# EAGLE schematic Arduino Shield Schematic (EAGLE 9.5.2)
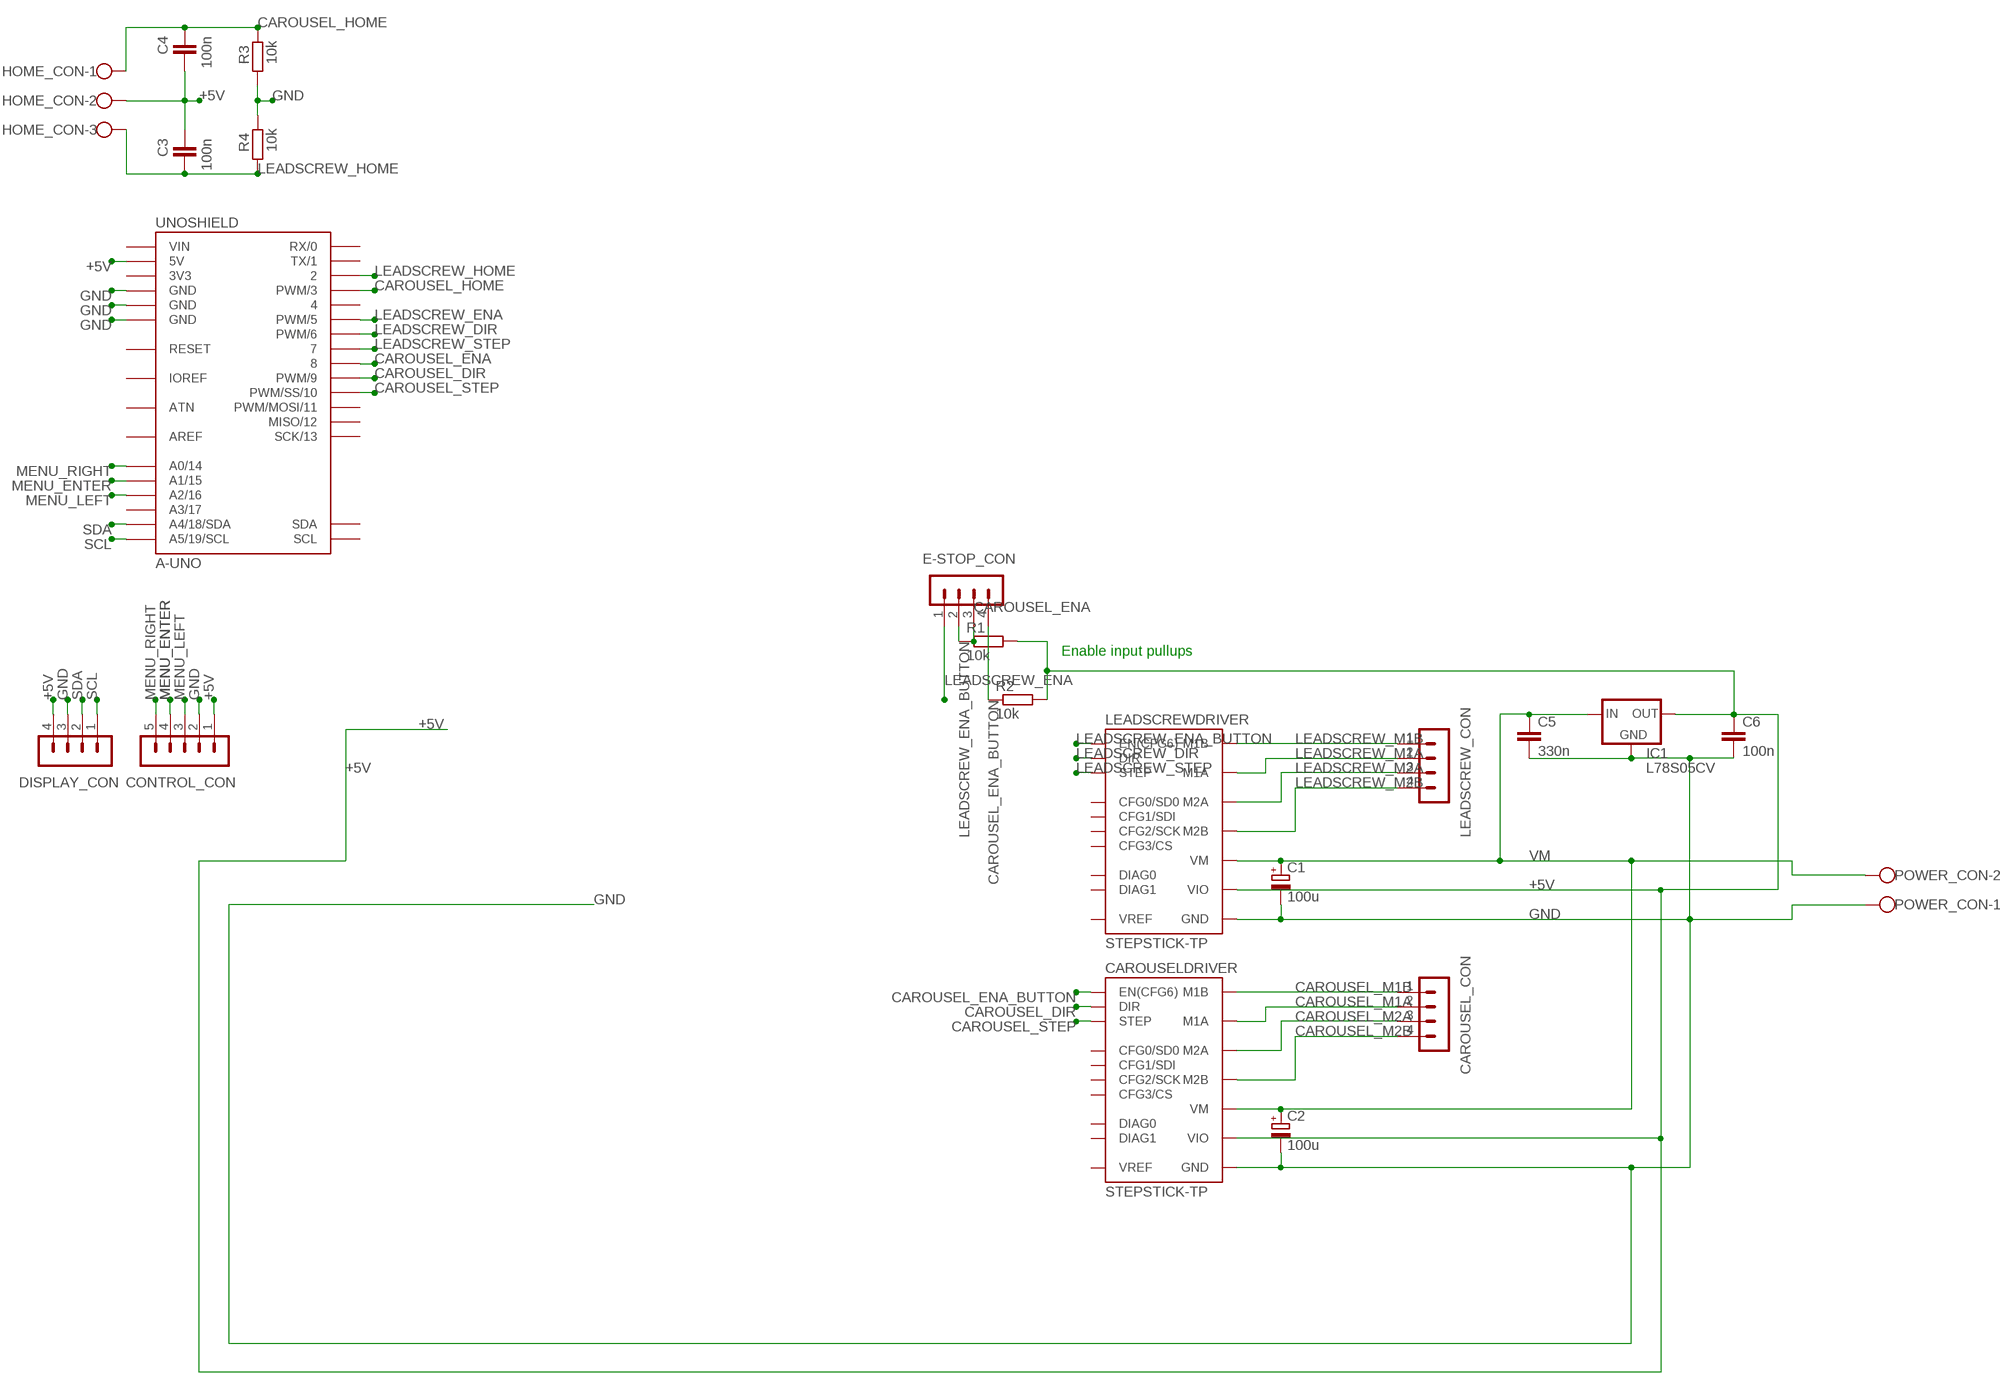
[diagram p0: schematic, sheet 1]

## Parts
C1  100u  CPOL-EUE3.5-8  [E3,5-8]
C2  100u  CPOL-EUE3.5-8  [E3,5-8]
C3  100n  C-EU025-024X044  [C025-024X044]
C4  100n  C-EU025-024X044  [C025-024X044]
C5  330n  C-EU025-030X050  [C025-030X050]
C6  100n  C-EU025-030X050  [C025-030X050]
CAROUSEL_CON  MA04-1  [MA04-1]
CAROUSELDRIVER  STEPSTICK-TP  [STEPSTICK_TP]
CONTROL_CON  MA05-1  [MA05-1]
DISPLAY_CON  MA04-1  [MA04-1]
E-STOP_CON  MA04-1  [MA04-1]
HOME_CON  W237-103  [W237-103]
IC1  L78S05CV  [TO-220-STANDING]
LEADSCREW_CON  MA04-1  [MA04-1]
LEADSCREWDRIVER  STEPSTICK-TP  [STEPSTICK_TP]
POWER_CON  W237-102  [W237-102]
R1  10k  R-EU_0207/12  [0207/12]
R2  10k  R-EU_0207/12  [0207/12]
R3  10k  R-EU_0207/10  [0207/10]
R4  10k  R-EU_0207/10  [0207/10]
UNOSHIELD  A-UNO  [A-UNO]

## Nets
+5V [Power]: C3.2 C4.1 C6.1 CAROUSELDRIVER.VIO CONTROL_CON.1 DISPLAY_CON.4 HOME_CON.2 IC1.3(OUT) LEADSCREWDRIVER.VIO R1.2 R2.2 UNOSHIELD.5V
CAROUSEL_DIR: CAROUSELDRIVER.DIR UNOSHIELD.9(PWM/9)
CAROUSEL_ENA: E-STOP_CON.3 UNOSHIELD.8
CAROUSEL_ENA_BUTTON: CAROUSELDRIVER.EN(EN(CFG6)) E-STOP_CON.4 R2.1
CAROUSEL_HOME: C4.2 HOME_CON.1 R3.2 UNOSHIELD.3(PWM/3)
CAROUSEL_M1A [Motors]: CAROUSEL_CON.2 CAROUSELDRIVER.M1A
CAROUSEL_M1B [Motors]: CAROUSEL_CON.1 CAROUSELDRIVER.M1B
CAROUSEL_M2A [Motors]: CAROUSEL_CON.3 CAROUSELDRIVER.M2A
CAROUSEL_M2B [Motors]: CAROUSEL_CON.4 CAROUSELDRIVER.M2B
CAROUSEL_STEP: CAROUSELDRIVER.STEP UNOSHIELD.10(PWM/SS/10)
GND [Power]: C1.- C2.- C5.2 C6.2 CAROUSELDRIVER.GND@1(GND) CAROUSELDRIVER.GND@2(GND) CONTROL_CON.2 DISPLAY_CON.3 IC1.2(GND) LEADSCREWDRIVER.GND@1(GND) LEADSCREWDRIVER.GND@2(GND) POWER_CON.1 R3.1 R4.2 UNOSHIELD.GND@1(GND) UNOSHIELD.GND@2(GND) UNOSHIELD.GND@3(GND)
LEADSCREW_DIR: LEADSCREWDRIVER.DIR UNOSHIELD.6(PWM/6)
LEADSCREW_ENA: E-STOP_CON.1 UNOSHIELD.5(PWM/5)
LEADSCREW_ENA_BUTTON: E-STOP_CON.2 LEADSCREWDRIVER.EN(EN(CFG6)) R1.1
LEADSCREW_HOME: C3.1 HOME_CON.3 R4.1 UNOSHIELD.2
LEADSCREW_M1A [Motors]: LEADSCREW_CON.2 LEADSCREWDRIVER.M1A
LEADSCREW_M1B [Motors]: LEADSCREW_CON.1 LEADSCREWDRIVER.M1B
LEADSCREW_M2A [Motors]: LEADSCREW_CON.3 LEADSCREWDRIVER.M2A
LEADSCREW_M2B [Motors]: LEADSCREW_CON.4 LEADSCREWDRIVER.M2B
LEADSCREW_STEP: LEADSCREWDRIVER.STEP UNOSHIELD.7
MENU_ENTER: CONTROL_CON.4 UNOSHIELD.A1(A1/15)
MENU_LEFT: CONTROL_CON.3 UNOSHIELD.A2(A2/16)
MENU_RIGHT: CONTROL_CON.5 UNOSHIELD.A0(A0/14)
SCL: DISPLAY_CON.1 UNOSHIELD.A5(A5/19/SCL)
SDA: DISPLAY_CON.2 UNOSHIELD.A4(A4/18/SDA)
VM [Power]: C1.+ C2.+ C5.1 CAROUSELDRIVER.VM IC1.1(IN) LEADSCREWDRIVER.VM POWER_CON.2
Unconnected: CAROUSELDRIVER.CFG1(CFG1/SDI) CAROUSELDRIVER.CFG2(CFG2/SCK) CAROUSELDRIVER.CFG3(CFG3/CS) CAROUSELDRIVER.DIAG0 CAROUSELDRIVER.DIAG1 CAROUSELDRIVER.NC/CFG0(CFG0/SD0) CAROUSELDRIVER.VREF LEADSCREWDRIVER.CFG1(CFG1/SDI) LEADSCREWDRIVER.CFG2(CFG2/SCK) LEADSCREWDRIVER.CFG3(CFG3/CS) LEADSCREWDRIVER.DIAG0 LEADSCREWDRIVER.DIAG1 LEADSCREWDRIVER.NC/CFG0(CFG0/SD0) LEADSCREWDRIVER.VREF UNOSHIELD.0(RX/0) UNOSHIELD.1(TX/1) UNOSHIELD.4 UNOSHIELD.11(PWM/MOSI/11) UNOSHIELD.12(MISO/12) UNOSHIELD.13(SCK/13) UNOSHIELD.A3(A3/17) UNOSHIELD.ATN UNOSHIELD.RST(RESET) UNOSHIELD.SCL UNOSHIELD.SDA

## Notes on the sheet
- Enable input pullups

## Power pins joined to a net without a drawn wire
3V3: UNOSHIELD.3V3
AREF: UNOSHIELD.AREF
IOREF: UNOSHIELD.IOREF
VIN: UNOSHIELD.VIN

## Library data of the parts
C1 C2 = rcl:CPOL-EU: POLARIZED CAPACITOR, European symbol; SPICEPREFIX: C
C3-C6 = rcl:C-EU: CAPACITOR, European symbol; SPICEPREFIX: C
CAROUSEL_CON DISPLAY_CON E-STOP_CON LEADSCREW_CON = con-lstb:MA04-1: PIN HEADER; OC_FARNELL: unknown; OC_NEWARK: unknown
CAROUSELDRIVER LEADSCREWDRIVER = we-board:STEPSTICK: SilentStepStick - Trinamic TMC2100/TMC2130 Stepper Motor Driver TMC2100 - CFG pins for configuration TMC2130 - SPI for configuration Pin CFG0/SDO only available on TMC2130 SilentStepStick.
CONTROL_CON = con-lstb:MA05-1: PIN HEADER; OC_FARNELL: unknown; OC_NEWARK: unknown
HOME_CON = con-wago-500:W237-103: WAGO SCREW CLAMP; MPN: 237-103; OC_FARNELL: unknown; OC_NEWARK: 18M7116
IC1 = L78S05CV:L78S05CV; AVAILABILITY: Unavailable; DESCRIPTION: L78S05 Series 2 A 5 V Fixed Output Positive Voltage Regulator - TO-220; MF: STMicroelectronics; MP: L78S05CV; PACKAGE: TO-220 STMicroelectronics; PRICE: None
POWER_CON = con-wago-500:W237-102: WAGO SCREW CLAMP; MPN: 237-102; OC_FARNELL: unknown; OC_NEWARK: 70K9898
R1-R4 = rcl:R-EU_: RESISTOR, European symbol; SPICEPREFIX: R
UNOSHIELD = we-board:A-UNO: Arduino/Genuino Uno

## Net classes
1 Power: width 0.508 mm
2 Motors: width 0.381 mm